# EAGLE schematic InputBrd (EAGLE 7.6.0)
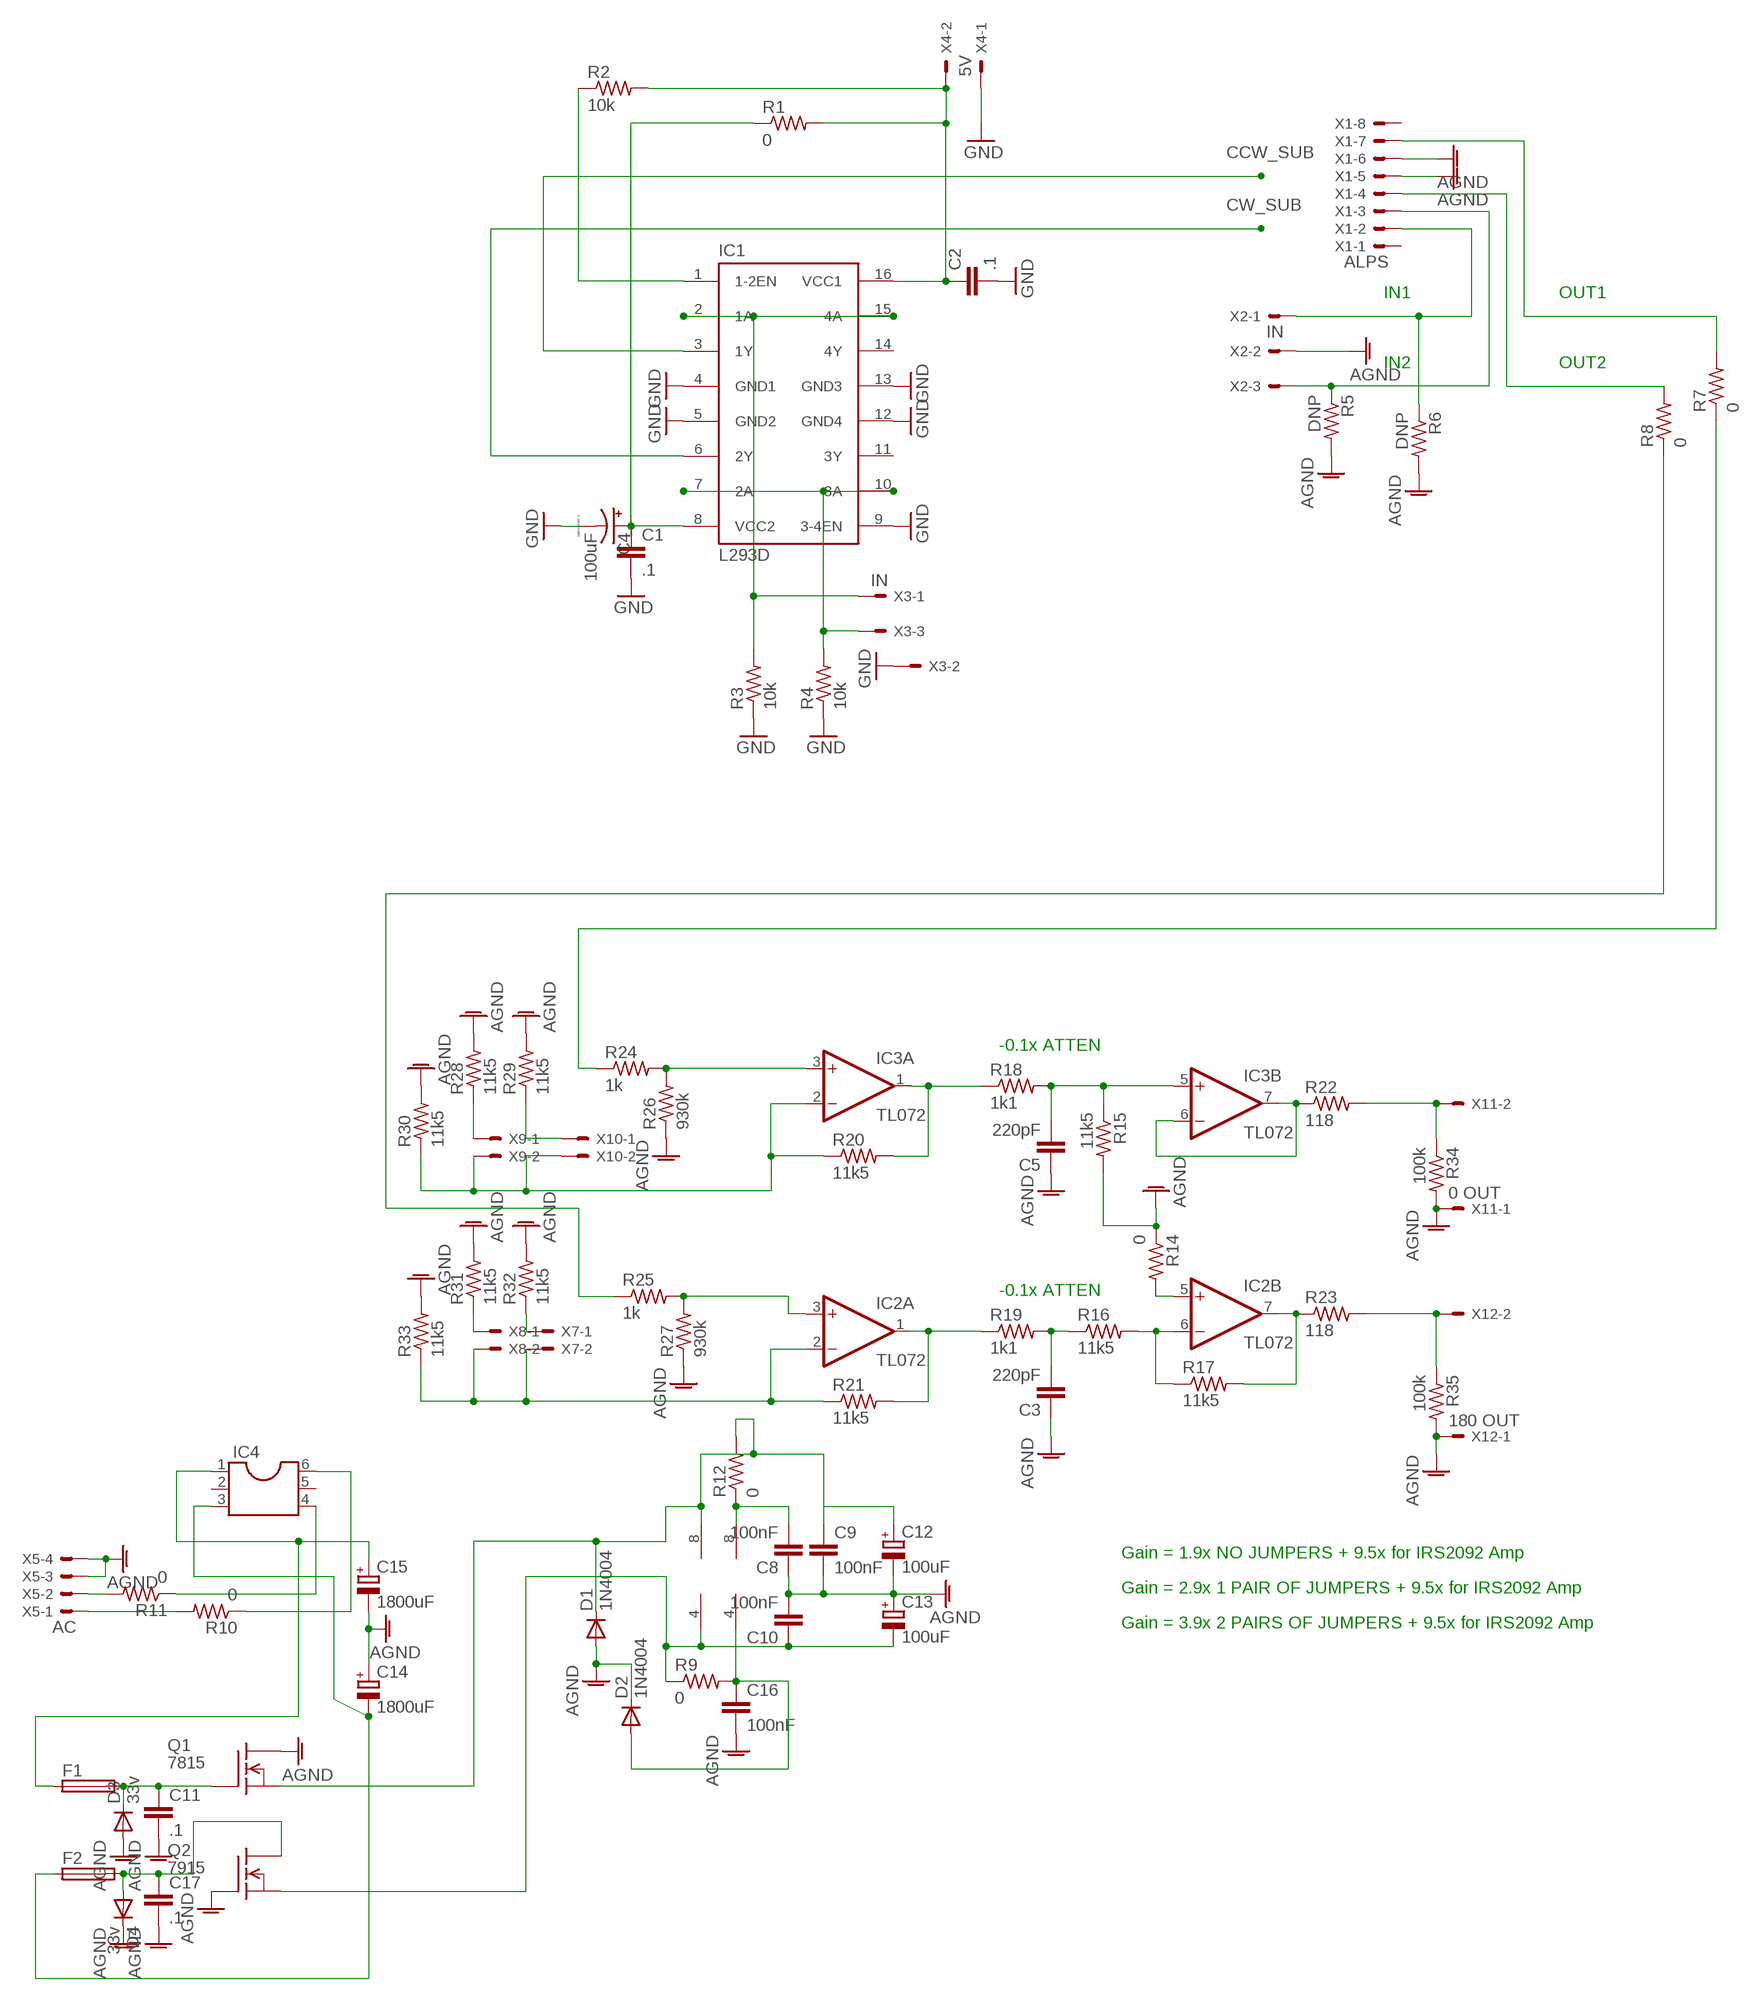
[diagram p0: schematic, sheet 1]

## Parts
C1  .1  C-EUC1210  [C1210]
C2  .1  C-EUC1210  [C1210]
C3  220pF  C-EU050-035X075  [C050-035X075]
C4  100uF  CPOL-USE2,5-6E  [E2,5-6E]
C5  220pF  C-EU050-035X075  [C050-035X075]
C8  100nF  C-EUC1210  [C1210]
C9  100nF  C-EUC1210  [C1210]
C10  100nF  C-EUC1210  [C1210]
C11  .1  C-EUC1210  [C1210]
C12  100uF  CPOL-EUE3.5-10  [E3,5-10]
C13  100uF  CPOL-EUE3.5-10  [E3,5-10]
C14  1800uF  CPOL-EUE7.5-16  [E7,5-16]
C15  1800uF  CPOL-EUE7.5-16  [E7,5-16]
C16  100nF  C-EUC1210  [C1210]
C17  .1  C-EUC1210  [C1210]
D1  1N4004  [DO41-10]
D2  1N4004  [DO41-10]
D3  33v  BYT08P  [TO220ACS]
D4  33v  BYT08P  [TO220ACS]
F1  19560  [19560]
F2  19560  [19560]
IC1  L293D  [DIL16]
IC2  TL072  LM1458N  [DIL08]
IC3  TL072  LM1458N  [DIL08]
IC4  DIL6  [DIL06]
Q1  7815  BUZ71  [TO220]
Q2  7915  BUZ71  [TO220]
R1  0  R-US_0207/15  [0207/15]
R2  10k  R-US_R1210  [R1210]
R3  10k  R-US_R1210  [R1210]
R4  10k  R-US_R1210  [R1210]
R5  DNP  R-US_0309/10  [0309/10]
R6  DNP  R-US_0309/10  [0309/10]
R7  0  R-US_0309/12  [0309/12]
R8  0  R-US_0309/12  [0309/12]
R9  0  R-US_0309/10  [0309/10]
R10  0  R-US_0309/V  [0309V]
R11  0  R-US_0309/V  [0309V]
R12  0  R-US_0309/10  [0309/10]
R14  0  R-US_0309/12  [0309/12]
R15  11k5  R-US_0309/12  [0309/12]
R16  11k5  R-US_0309/10  [0309/10]
R17  11k5  R-US_0309/10  [0309/10]
R18  1k1  R-US_0309/12  [0309/12]
R19  1k1  R-US_0309/12  [0309/12]
R20  11k5  R-US_0309/10  [0309/10]
R21  11k5  R-US_0309/10  [0309/10]
R22  118  R-US_0309/12  [0309/12]
R23  118  R-US_0309/10  [0309/10]
R24  1k  R-US_0411/15  [0411/15]
R25  1k  R-US_0309/12  [0309/12]
R26  930k  R-US_0309/10  [0309/10]
R27  930k  R-US_0309/10  [0309/10]
R28  11k5  R-US_0309/10  [0309/10]
R29  11k5  R-US_0309/10  [0309/10]
R30  11k5  R-US_0309/10  [0309/10]
R31  11k5  R-US_0309/10  [0309/10]
R32  11k5  R-US_0309/10  [0309/10]
R33  11k5  R-US_0309/10  [0309/10]
R34  100k  R-US_0309/12  [0309/12]
R35  100k  R-US_0309/10  [0309/10]
X1  ALPS  22-23-2081  [22-23-2081]
X2  IN  22-23-2031  [22-23-2031]
X3  IN  22-23-2031  [22-23-2031]
X4  5V  22-23-2021  [22-23-2021]
X5  AC  5566-4  [5566-4]
X7  22-23-2021  [22-23-2021]
X8  22-23-2021  [22-23-2021]
X9  22-23-2021  [22-23-2021]
X10  22-23-2021  [22-23-2021]
X11  0 OUT  22-23-2021  [22-23-2021]
X12  180 OUT  22-23-2021  [22-23-2021]

## Nets
AGND: C3.1 C5.1 C8.1 C9.2 C10.2 C11.2 C12.- C13.+ C14.+ C15.- C16.2 C17.2 D1.A D2.C D3.A D4.C Q1.2(D) Q2.1(G) R5.2 R6.2 R14.1 R15.2 R26.1 R27.1 R28.2 R29.2 R30.2 R31.2 R32.2 R33.2 R34.2 R35.2 X1.5 X1.6 X2.2 X5.3 X5.4 X11.1 X12.1
CCW_SUB: IC1.3(1Y)
CW_SUB: IC1.6(2Y)
GND: C1.2 C2.2 C4.- IC1.4(GND1) IC1.5(GND2) IC1.9(3-4EN) IC1.12(GND4) IC1.13(GND3) R3.1 R4.1 X3.2 X4.1
N$1: IC1.7(2A) IC1.10(3A) R4.2 X3.3
N$2: IC1.2(1A) IC1.15(4A) R3.2 X3.1
N$3: R6.1 X1.2 X2.1
N$4: R7.2 X1.7
N$5: R5.1 X1.3 X2.3
N$6: R7.1 R24.1
N$7: IC1.1(1-2EN) R2.1
N$8: C1.1 C4.+ IC1.8(VCC2) R1.1
N$9: R8.2 X1.4
N$10: C11.1 D3.C F1.2 Q1.1(G)
N$11: C2.1 IC1.16(VCC1) R1.2 R2.2 X4.2
N$12: C17.1 D4.A F2.2 Q2.2(D)
N$13: C16.1 D2.A IC3.4(P:V-) R9.2
N$15: C8.2 IC3.8(P:V+) R12.1
N$16: R11.2 X5.2
N$17: R10.2 X5.1
N$18: IC4.6 R10.1
N$19: IC4.4 R11.1
N$20: C15.+ F1.1 IC4.1
N$21: C14.- F2.1 IC4.3
N$23: C9.1 C12.+ D1.C IC2.8(P:V+) Q1.3(S) R12.2
N$24: C10.1 C13.- IC2.4(P:V-) Q2.3(S) R9.1
N$25: IC3.6(B:-IN) IC3.7(B:OUT) R22.1
N$26: IC2.5(B:+IN) R14.2
N$27: C5.2 IC3.5(B:+IN) R15.1 R18.2
N$28: IC2.6(B:-IN) R16.2 R17.1
N$29: IC2.7(B:OUT) R17.2 R23.1
N$30: C3.2 R16.1 R19.2
N$31: IC3.1(A:OUT) R18.1 R20.2
N$32: IC2.1(A:OUT) R19.1 R21.2
N$33: IC3.3(A:+IN) R24.2 R26.2
N$34: IC3.2(A:-IN) R20.1 R30.1 X9.2 X10.2
N$35: IC2.2(A:-IN) R21.1 R33.1 X7.2 X8.2
N$36: IC2.3(A:+IN) R25.2 R27.2
N$37: R31.1 X8.1
N$38: R32.1 X7.1
N$39: R29.1 X10.1
N$40: R28.1 X9.1
N$43: R22.2 R34.1 X11.2
N$44: R23.2 R35.1 X12.2
N$47: R8.1 R25.1
Unconnected: IC1.11(3Y) IC1.14(4Y) IC4.2 IC4.5 X1.1 X1.8

## Notes on the sheet
- IN1 | OUT1
- IN2 | OUT2
- -0.1x ATTEN
- -0.1x ATTEN
- Gain = 1.9x NO JUMPERS + 9.5x for IRS2092 Amp
- Gain = 2.9x 1 PAIR OF JUMPERS + 9.5x for IRS2092 Amp
- Gain = 3.9x 2 PAIRS OF JUMPERS + 9.5x for IRS2092 Amp

## Library data of the parts
C1-C3 C5 C8-C11 C16 C17 = resistor:C-EU: CAPACITOR, European symbol
C4 = resistor:CPOL-US: POLARIZED CAPACITOR, American symbol
C12-C15 = resistor:CPOL-EU: POLARIZED CAPACITOR, European symbol
D1 D2 = diode:1N4004: DIODE general purpose rectifier, 1 A
D3 D4 = diode:BYT08P: DIODE ultra fast
F1 F2 = fuse:19560: FUSE HOLDER TR5, Wickmann; MPN: 56000001009; OC_FARNELL: 1185363; OC_NEWARK: 15P8392
IC1 = st-microelectronics:L293D: PUSH-PULL 4 CHANNEL DRIVER; MPN: L293D; OC_FARNELL: 9589619; OC_NEWARK: 56P8249
IC2 IC3 = linear:*1458: OP AMP
IC4 = ic-package:DIL6: Dual In Line / Socket
Q1 Q2 = transistor-fet:BUZ71: N-Channel Enhancement MOSFET 50V; 14A; 0,1Ohm
R1-R12 R14-R35 = resistor:R-US_: RESISTOR, American symbol
X1 = con-molex:22-23-2081: .100" (2.54mm) Center Header - 8 Pin; MF: MOLEX; MPN: 22-23-2081; OC_FARNELL: 1756826; OC_NEWARK: 01C7592
X2 X3 = con-molex:22-23-2031: .100" (2.54mm) Center Header - 3 Pin; MF: MOLEX; MPN: 22-23-2031; OC_FARNELL: 1462950; OC_NEWARK: 30C0862
X4 X7-X12 = con-molex:22-23-2021: .100" (2.54mm) Center Header - 2 Pin; MF: MOLEX; MPN: 22-23-2021; OC_FARNELL: 1462926; OC_NEWARK: 25C3832
X5 = con-molex:5566-4: Mini FIT connector 4 pol Source: http://www.molex.com; OC_FARNELL: unknown; OC_NEWARK: unknown